# Altium project MB1272.PrjPcb (part 3 of 5)

## Sheet ST_LINK_V2-1.SCHDOC: ST-LINK/V2-1 with support of SWD only
size A4; Project: STM32MP15-DISCO PI; Date: Not used; ApprovedBy: Not used; CheckedBy: Not used; Author: Not used; CompanyName: STMicroelectronics; DrawnBy: Not used; Engineer: Not used; Organization: Not used; Address1: Not used; Address2: Not used; Address3: Not used; Address4: Not used; DocumentNumber: 15; Revision: Not used; SheetNumber: 15; SheetTotal: 15; CurrentTime: Not used; CurrentDate: Not used; Time: Not used; DocumentFullPathAndName: Not used; DocumentName: Not used; ModifiedDate: Not used; ImagePath: Not used; ProjectName: Not used; Application_BuildNumber: Not used
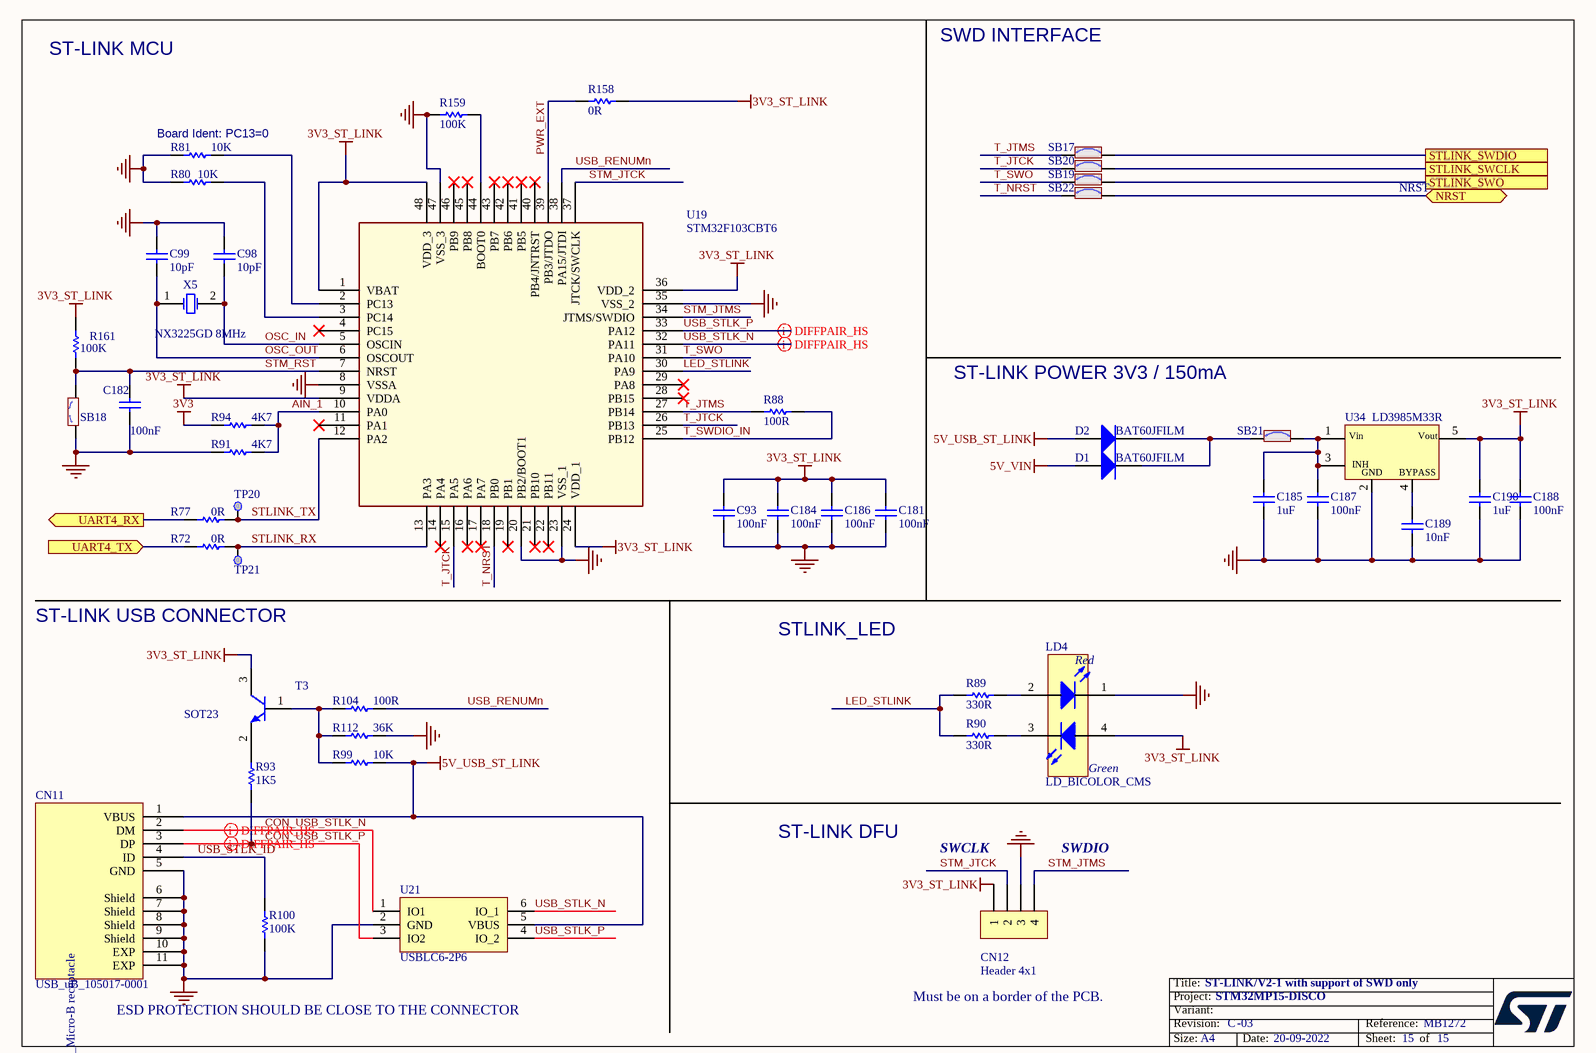
[diagram p6: ST_LINK_V2-1.SCHDOC]

### Parts
C93  value 100nF  [C0402]
C98  value 10pF  [C0402]
C99  value 10pF  [C0402]
C181  value 100nF  [C0402]
C182  value 100nF  [C0402]
C184  value 100nF  [C0402]
C185  value 1uF  [C0603]
C186  value 100nF  [C0402]
C187  value 100nF  [C0402]
C188  value 100nF  [C0402]
C189  value 10nF  [C0402]
C190  value 1uF  [C0603]
CN11  value USB_uB_105017-0001  [CON_USBMICROB_MOLEX_105017-0001_H2P90]
CN12  value Header 4x1  [CON_SAMTEC_TSW-104-07-G-S]
D1  value BAT60JFILM  [DIO_SOD323]
D2  value BAT60JFILM  [DIO_SOD323]
LD4  LD_BICOLOR_CMS  [LED_BI-GR_HSMF-A201-A00J1]
R72  value 0R  [R0402]
R77  value 0R  [R0402]
R80  value 10K  [R0402]
R81  value 10K  [R0402]
R88  value 100R  [R0402]
R89  value 330R  [R0402]
R90  value 330R  [R0402]
R91  value 4K7  [R0402]
R93  value 1K5  [R0402]
R94  value 4K7  [R0402]
R99  value 10K  [R0402]
R100  value 100K  [R0402]
R104  value 100R  [R0402]
R112  value 36K  [R0402]
R158  value 0R  [R0402]
R159  value 100K  [R0402]
R161  value 100K  [R0402]
SB17  (no value)  [SOLDER-BRIDGE_R0603-0R]
SB18  (no value)  [SOLDER-BRIDGE_R0603-0R]
SB19  (no value)  [SOLDER-BRIDGE_R0603-0R]
SB20  (no value)  [SOLDER-BRIDGE_R0603-0R]
SB21  (no value)  [SOLDER-BRIDGE_R0603-0R]
SB22  (no value)  [SOLDER-BRIDGE_R0603-0R]
T3  value SOT23  [NPN_SOT23]
TP20  Test Point  [TP_SMD_1MM]  (value not drawn)  (no BOM)
TP21  Test Point  [TP_SMD_1MM]  (value not drawn)  (no BOM)
U19  value STM32F103CBT6  [ICC_LQFP48_7X7_P050]
U21  value USBLC6-2P6  [ESD_SOT666]
U34  value LD3985M33R  [REG_SOT23-5L]
X5  value NX3225GD 8MHz  [CRY_NX3225GD_2P]

### Ports
NRST (bidir), STLINK_SWCLK, STLINK_SWDIO, STLINK_SWO, UART4_RX (out), UART4_TX (in)

### Nets
3V3: R94.1
3V3_ST_LINK: C93.2 C181.2 C184.2 C186.2 C188.2 C190.2 CN12.1 LD4.4(YellowGreen_anode) R158.2 R161.2 T3.3(C) U19.1(VBAT) U19.9(VDDA) U19.24(VDD_1) U19.36(VDD_2) U19.48(VDD_3) U34.5(Vout)
5V_USB_ST_LINK: CN11.1(VBUS) D2.1(A) R99.1 U21.5(VBUS)
5V_VIN: D1.1(A)
GND: C93.1 C98.2 C99.2 C181.1 C182.1 C184.1 C185.2 C186.1 C187.1 C188.1 C189.1 C190.1 CN11.5(GND) CN11.6(Shield) CN11.7(Shield) CN11.8(Shield) CN11.9(Shield) CN11.10(EXP) CN11.11(EXP) CN12.3 LD4.1(RED_cathode) R80.1 R81.2 R91.1 R100.1 R112.1 R159.1 SB18.1 U19.8(VSSA) U19.20(PB2/BOOT1) U19.23(VSS_1) U19.35(VSS_2) U19.47(VSS_3) U21.2(GND) U34.2(GND)
AIN_1: R91.2 R94.2 U19.10(PA0)
CON_USB_STLK_N: CN11.2(DM) U21.1(IO1)
CON_USB_STLK_P: CN11.3(DP) R93.1 U21.3(IO2)
JTDO_TRACESWO: SB19.2 ; port STLINK_SWO
LED_STLINK: R89.2 R90.2 U19.30(PA9)
NRST: SB22.2 ; port NRST
OSC_IN: C98.1 U19.5(OSCIN) X5.2(OSC2)
OSC_OUT: C99.1 U19.6(OSCOUT) X5.1(OSC1)
PWR_EXT: R158.1 U19.39(PB3/JTDO)
STLINK_RX: R72.2 TP21.1 U19.13(PA3)
STLINK_SWCLK: SB20.2 ; port STLINK_SWCLK
STLINK_SWDIO: SB17.2 ; port STLINK_SWDIO
STLINK_TX: R77.1 TP20.1 U19.12(PA2)
STM_JTCK: CN12.2 U19.37(JTCK/SWCLK)
STM_JTMS: CN12.4 U19.34(JTMS/SWDIO)
STM_RST: C182.2 R161.1 SB18.2 U19.7(NRST)
T_JTCK: SB20.1 U19.15(PA5) U19.26(PB13)
T_JTMS: R88.1 SB17.1 U19.27(PB14)
T_NRST: SB22.1 U19.18(PB0)
T_SWDIO_IN: R88.2 U19.25(PB12)
T_SWO: SB19.1 U19.31(PA10)
UART4_RX: R77.2 ; port UART4_RX
UART4_TX: R72.1 ; port UART4_TX
USB_RENUMn: R104.2 U19.38(PA15/JTDI)
USB_STLK_ID: CN11.4(ID) R100.2
USB_STLK_N: U19.32(PA11) U21.6(IO_1)
USB_STLK_P: U19.33(PA12) U21.4(IO_2)
NetC185_1: C185.1 C187.2 SB21.2 U34.1(Vin) U34.3(CE)
NetC189_2: C189.2 U34.4(BYPASS)
NetD1_2: D1.2(K) D2.2(K) SB21.1
NetLD4_2: LD4.2(Red_anode) R89.1
NetLD4_3: LD4.3(YellowGreen_cathode) R90.1
NetR80_2: R80.2 U19.3(PC14)
NetR81_1: R81.1 U19.2(PC13)
NetR93_2: R93.2 T3.2(E)
NetR99_2: R99.2 R104.1 R112.2 T3.1(B)
NetR159_2: R159.2 U19.44(BOOT0)

Not connected (* = marked no-connect by the designer): U19 4(PC15)* 11(PA1)* 14(PA4)* 16(PA6)* 17(PA7)* 19(PB1)* 21(PB10)* 22(PB11)* 28(PB15)* 29(PA8)* 40(PB4/JNTRST)* 41(PB5)* 42(PB6)* 43(PB7)* 45(PB8)* 46(PB9)*

### Layout directives
differential pair: CON_USB_STLK_N, CON_USB_STLK_P, USB_STLK_N, USB_STLK_P

### Notes on the sheet
- ST-LINK MCU
- SWD INTERFACE
- (near R81) Board Ident: PC13=0
- NRST
- ST-LINK POWER 3V3 / 150mA
- ST-LINK USB CONNECTOR
- STLINK_LED
- ST-LINK DFU
- SWCLK
- SWDIO
- Must be on a border of the PCB.
- (near CN11) ESD PROTECTION SHOULD BE CLOSE TO THE CONNECTOR
- Title:
- Project:
- Size:
- Revision:
- Variant:
- A4
- -
- Date:
- Reference:
- Sheet:
- of
- (in symbol MCD-00028) USB_Micro-B receptacle
- (in symbol MCD-00086) INH
- (in symbol MCD-02402) Red; Green

### Library data of the parts
C93 C181 C182 C184 C186-C188 = MCD-00006: Capacitor,100nF,16V,X7R,10%,0402; Manufacturer_Part_Number: CC0402KRX7R7BB104; Manufacturer: YAGEO; Alternate_Manufacturer: MURATA; Alternate_Manufacturer_Part_Number: GCM155R71C104KA55D; Provided_By: SUBCO; Initial_Board_Reference: mb1274; Internal_Part_Number: MCD-00006; ComponentLink1Description: Datasheet; ECCN_US: n/a; ECCN_EU: n/a; Status: Released; Part_Type: Capacitor; Package: C0402; ComponentLink1URL: http://tunmcdsvn.tun.st.com/Component_Datasheet_Library/Trunk/Capacitors/Yageo_Multilayer_Capacitor_X7R_series_100pF_to_22uF
C98 C99 = MCD-00015: Capacitor,10pF,50V,NPO,5%,0402; Manufacturer_Part_Number: CC0402JRNPO9BN100; Manufacturer: YAGEO; Provided_By: SUBCO; Initial_Board_Reference: mb1274; Internal_Part_Number: MCD-00015; ComponentLink1Description: Datasheet; ECCN_US: n/a; ECCN_EU: n/a; Status: Released; Part_Type: Capacitor; Package: C0402; ComponentLink1URL: http://tunmcdsvn.tun.st.com/Component_Datasheet_Library/Trunk/Capacitors/Yageo_Capacitor_NP0_16V-to-50V
C185 C190 = MCD-00238: Capacitor,1uF,6V3,X5R,10%,0603; Manufacturer_Part_Number: CC0603KRX5R5BB105; Manufacturer: YAGEO; Provided_By: SUBCO; Initial_Board_Reference: mb1319; Internal_Part_Number: MCD-00238; ComponentLink1Description: Datasheet; ECCN_US: n/a; ECCN_EU: n/a; Status: Released; Part_Type: Capacitor; Package: C0603; ComponentLink1URL: http://tunmcdsvn.tun.st.com/Component_Datasheet_Library/Trunk/Capacitors/Yageo_Multilayer_capacitor_X5R_series_100pF_to_100uF
C189 = MCD-00011: Capacitor,10nF,16V,X7R,10%,0402; Manufacturer_Part_Number: CC0402KRX7R7BB103; Manufacturer: YAGEO; Provided_By: SUBCO; Initial_Board_Reference: mb1274; Internal_Part_Number: MCD-00011; ComponentLink1Description: Datasheet; ECCN_US: n/a; ECCN_EU: n/a; Status: Released; Part_Type: Capacitor; Package: C0402; ComponentLink1URL: http://tunmcdsvn.tun.st.com/Component_Datasheet_Library/Trunk/Capacitors/Yageo_Multilayer_Capacitor_X7R_series_100pF_to_22uF
CN11 = MCD-00028: USB-MICRO-B, 0.65mm, RA, SMT, Bottom Mount,; Manufacturer_Part_Number: 1050170001; Manufacturer: MOLEX; Part_Type: Connector; Provided_By: SUBCO; Initial_Board_Reference: mb1274; Internal_Part_Number: MCD-00028; ComponentLink1Description: Datasheet; ECCN_US: n/a; ECCN_EU: n/a; Status: Released; ComponentLink1URL: http://tunmcdsvn.tun.st.com/Component_Datasheet_Library/Trunk/Connectors/Molex_Connector-USB-microB_105017-0001
CN12 = MCD-00029: Header, 4x1, 2,54mm, VR, TH, Height 5.84mm/2.54mm; Manufacturer_Part_Number: TSW-104-07-x-S; Manufacturer: SAMTEC; Part_Type: Connector; Provided_By: SUBCO; Initial_Board_Reference: mb1274; Internal_Part_Number: MCD-00029; ComponentLink1Description: Datasheet; ECCN_US: n/a; ECCN_EU: n/a; Status: Released; ComponentLink1URL: http://tunmcdsvn.tun.st.com/Component_Datasheet_Library/Trunk/Connectors/Samtec_TSW-HTSW-series
D1 D2 = MCD-00034: BAT60JFILM; Manufacturer: STMICROELECTRONICS; Part_Type: Diode; BMS_Part_Number: 9151097; ECCN_US: EAR99; ECCN_EU: NEC; Provided_By: SUBCO with ST control; Initial_Board_Reference: mb1274; Internal_Part_Number: MCD-00034; Manufacturer_Part_Number: BAT60JFILM; ComponentLink1Description: Datasheet; Status: Released; ComponentLink1URL: http://tunmcdsvn.tun.st.com/Component_Datasheet_Library/Trunk/Diodes/STM_Diode_BAT60JFILM-SOD323
LD4 = MCD-02402: LED Bicolor; Part_Type: Display; Part_Preference: Alternate; Manufacturer: EVERLIGHT; Manufacturer_Part_Number: 67-22sursygc-s530-a2-tr8; Full_Alternate_Internal_Part_Number: MCD-00051, MCD-02631; Alternate_EMS: C; ShowFields: YES; ID: 4508; Internal_Part_Number: MCD-02402; Value: LD_BICOLOR_CMS; Status: Released; ComponentLink1URL: http://tunmcdsvn.tun.st.com/Component_Documentation_Library/Trunk/Display/EVERLIGHT_67-22sursygc-s530-a2-tr8; Order_Code_Digikey: N/A; Order_Code_Farnell: N/A; Order_Code_RS: N/A
R72 R77 R158 = MCD-00052: Resistor,0R,0402,5%,1/16W; Manufacturer_Part_Number: RC0402JR-070RL; Manufacturer: YAGEO; Provided_By: SUBCO; Initial_Board_Reference: mb1274; Internal_Part_Number: MCD-00052; ComponentLink1Description: Datasheet; ECCN_US: n/a; ECCN_EU: n/a; Status: Released; Part_Type: Resistor; ComponentLink1URL: http://tunmcdsvn.tun.st.com/Component_Datasheet_Library/Trunk/Resistors/Yageo_Resistor_RC0402-series; Package: R0402
R80 R81 R99 = MCD-00053: Resistor,10K,0402,1%,1/16W; Manufacturer_Part_Number: RC0402FR-0710KL; Manufacturer: YAGEO; Provided_By: SUBCO; Initial_Board_Reference: mb1274; Internal_Part_Number: MCD-00053; ComponentLink1Description: Datasheet; ECCN_US: n/a; ECCN_EU: n/a; Status: Released; Part_Type: Resistor; ComponentLink1URL: http://tunmcdsvn.tun.st.com/Component_Datasheet_Library/Trunk/Resistors/Yageo_Resistor_RC0402-series; Package: R0402
R88 R104 = MCD-00067: Resistor,100R,0402,1%,1/16W; Manufacturer_Part_Number: RC0402FR-07100RL; Manufacturer: YAGEO; Provided_By: SUBCO; Initial_Board_Reference: mb1274; Internal_Part_Number: MCD-00067; ComponentLink1Description: Datasheet; ECCN_US: n/a; ECCN_EU: n/a; Status: Released; Part_Type: Resistor; ComponentLink1URL: http://tunmcdsvn.tun.st.com/Component_Datasheet_Library/Trunk/Resistors/Yageo_Resistor_RC0402-series; Package: R0402
R89 R90 = MCD-00062: Resistor,330R,0402,1%,1/16W; Manufacturer_Part_Number: RC0402FR-07330RL; Manufacturer: YAGEO; Provided_By: SUBCO; Initial_Board_Reference: mb1274; Internal_Part_Number: MCD-00062; ComponentLink1Description: Datasheet; ECCN_US: n/a; ECCN_EU: n/a; Status: Released; Part_Type: Resistor; ComponentLink1URL: http://tunmcdsvn.tun.st.com/Component_Datasheet_Library/Trunk/Resistors/Yageo_Resistor_RC0402-series; Package: R0402
R91 R94 = MCD-00065: Resistor,4K7,0402,1%,1/16W; Manufacturer_Part_Number: RC0402FR-074K7L; Manufacturer: YAGEO; Alternate_Manufacturer_Part_Number: RT0402FRE074K7L; Provided_By: SUBCO; Initial_Board_Reference: mb1274; Internal_Part_Number: MCD-00065; Alternate_Manufacturer: YAGEO; ComponentLink1Description: Datasheet; ECCN_US: n/a; ECCN_EU: n/a; Status: Released; Part_Type: Resistor; ComponentLink1URL: http://tunmcdsvn.tun.st.com/Component_Datasheet_Library/Trunk/Resistors/Yageo_Resistor_RC0402-series; Package: R0402
R93 = MCD-00068: Resistor,1K5,0402,1%,1/16W; Manufacturer_Part_Number: RC0402FR-071K5L; Manufacturer: YAGEO; Provided_By: SUBCO; Initial_Board_Reference: mb1274; Internal_Part_Number: MCD-00068; ComponentLink1Description: Datasheet; ECCN_US: n/a; ECCN_EU: n/a; Status: Released; Part_Type: Resistor; ComponentLink1URL: http://tunmcdsvn.tun.st.com/Component_Datasheet_Library/Trunk/Resistors/Yageo_Resistor_RC0402-series; Package: R0402
R100 R159 R161 = MCD-00059: Resistor,100K,0402,1%,1/16W; Manufacturer_Part_Number: RC0402FR-07100KL; Manufacturer: YAGEO; Alternate_Manufacturer_Part_Number: RT0402FRE07100KL; Provided_By: SUBCO; Initial_Board_Reference: mb1274; Internal_Part_Number: MCD-00059; Alternate_Manufacturer: YAGEO; ComponentLink1Description: Datasheet; ECCN_US: n/a; ECCN_EU: n/a; Status: Released; Part_Type: Resistor; ComponentLink1URL: http://tunmcdsvn.tun.st.com/Component_Datasheet_Library/Trunk/Resistors/Yageo_Resistor_RC0402-series; Package: R0402
R112 = MCD-00069: Resistor,36K,0402,1%,1/16W; Manufacturer_Part_Number: RC0402FR-0736KL; Manufacturer: YAGEO; Provided_By: SUBCO; Initial_Board_Reference: mb1274; Internal_Part_Number: MCD-00069; ComponentLink1Description: Datasheet; ECCN_US: n/a; ECCN_EU: n/a; Status: Released; Part_Type: Resistor; ComponentLink1URL: http://tunmcdsvn.tun.st.com/Component_Datasheet_Library/Trunk/Resistors/Yageo_Resistor_RC0402-series; Package: R0402
SB17 SB19-SB22 = MCD-00071: Solder Bridge ON; Part_Type: Mechanical; Manufacturer: YAGEO; Manufacturer_Part_Number: RC0603JR-070RL; Provided_By: SUBCO; Initial_Board_Reference: mb1274; Internal_Part_Number: MCD-00071; ECCN_US: n/a; ECCN_EU: n/a; Status: Released; ComponentLink1Description: Datasheet; ComponentLink1URL: http://tunmcdsvn.tun.st.com/Component_Datasheet_Library/Trunk/Resistors/Yageo_Resistor_RC0603-series; Package: SB0603
SB18 = MCD-00072: Solder Bridge OFF; Part_Type: Mechanical; Manufacturer: YAGEO; Manufacturer_Part_Number: RC0603JR-070RL; Provided_By: SUBCO; Initial_Board_Reference: mb1274; Internal_Part_Number: MCD-00072; ECCN_US: n/a; ECCN_EU: n/a; Status: Released; ComponentLink1Description: Datasheet; ComponentLink1URL: http://tunmcdsvn.tun.st.com/Component_Datasheet_Library/Trunk/Resistors/Yageo_Resistor_RC0603-series; Package: SB0603
T3 = MCD-00073: NPN Bipolar Transistor; Manufacturer_Part_Number: BSR14; Manufacturer: ON SEMICONDUCTOR; Part_Type: IC; Alternate_Manufacturer_Part_Number: MMBT2222ALT1G / MMBT2222ALT3G; ECCN_US: EAR99; ECCN_EU: NEC; Provided_By: SUBCO; Initial_Board_Reference: mb1274; Revision: *; Internal_Part_Number: MCD-00073; ComponentLink1Description: Datasheet; Status: Released; ComponentLink1URL: http://tunmcdsvn.tun.st.com/Component_Datasheet_Library/Trunk/IC/NXP_Transistor_BSR14; Alternate_Manufacturer: ON SEMICONDUCTOR
TP20 TP21 = MCD-00074: Test Point 1mm; Part_Type: Mechanical; Initial_Board_Reference: MB1274; Internal_Part_Number: MCD-00074; Status: Released; Manufacturer_Part_Number: n/a; Manufacturer: n/a; ComponentLink1Description: Datasheet; ComponentLink1URL: http://na; ECCN_US: n/a; ECCN_EU: n/a; Provided_By: n/a
U19 = MCD-00085: Medium-density performance line ARM-based 32-bit MCU with 128KB Flash; Manufacturer: STMICROELECTRONICS; Part_Type: IC; BMS_Part_Number: 9175111; ECCN_US: 3A991A2; ECCN_EU: NEC; Provided_By: SUBCO with ST control; Initial_Board_Reference: mb1274; Internal_Part_Number: MCD-00085; Manufacturer_Part_Number: STM32F103CBT6; ComponentLink1Description: Datasheet; Status: Released; ComponentLink1URL: http://tunmcdsvn.tun.st.com/Component_Datasheet_Library/Trunk/IC/STM_STM32F103CBT6
U21 = MCD-00169: USB OTG FS ESD protection; Manufacturer: STMICROELECTRONICS; Part_Type: IC; BMS_Part_Number: 9151057; Provided_By: SUBCO with ST control; ECCN_US: EAR99; ECCN_EU: NEC; Initial_Board_Reference: MB1274; Internal_Part_Number: MCD-00169; Manufacturer_Part_Number: USBLC6-2P6; ComponentLink1Description: Datasheet; Status: Released; ComponentLink1URL: http://tunmcdsvn.tun.st.com/Component_Datasheet_Library/Trunk/Diodes/STM_ESD_USBLC6-2
U34 = MCD-00086: Ultra low drop-low noise BiCMOS voltage, regulators low ESR capacitors compatible; Manufacturer: STMICROELECTRONICS; Part_Type: IC; BMS_Part_Number: 9176161; ECCN_US: EAR99; ECCN_EU: NEC; Provided_By: SUBCO with ST control; Initial_Board_Reference: mb1274; Internal_Part_Number: MCD-00086; Manufacturer_Part_Number: LD3985M33R; ComponentLink1Description: Datasheet; Status: Released; ComponentLink1URL: http://tunmcdsvn.tun.st.com/Component_Datasheet_Library/Trunk/IC/STM_LDO_LD3985
X5 = MCD-00092: Crystal 8Mhz, 8pF, -+50PPM, SMD; Manufacturer_Part_Number: NX3225GD 8MHz EXS00A-CG04874; Manufacturer: NDK; Part_Type: Crystal_Osc; BMS_Part_Number: 9157029; ECCN_US: EAR99; ECCN_EU: NEC; Provided_By: SUBCO; Initial_Board_Reference: mb1274; Internal_Part_Number: MCD-00092; ComponentLink1Description: Datasheet; Status: Released; ComponentLink1URL: http://tunmcdsvn.tun.st.com/Component_Datasheet_Library/Trunk/Crystal_Osc/NDK_Crystal-For-ST_NX3225GD 8MHz EXS00A-CG04874 (EXS10B-20725)

## Sheet GPIO_&_Arduino_ Connectors.SchDoc: GPIO_&_Arduino_ Connectors
size A3; Project: STM32MP15-DISCO PI; Date: Not used; ApprovedBy: Not used; CheckedBy: Not used; Author: Not used; CompanyName: STMicroelectronics; DrawnBy: Not used; Engineer: Not used; Organization: Not used; Address1: Not used; Address2: Not used; Address3: Not used; Address4: Not used; DocumentNumber: 10; Revision: Not used; SheetNumber: 10; SheetTotal: 15; CurrentTime: Not used; CurrentDate: Not used; Time: Not used; DocumentFullPathAndName: Not used; DocumentName: Not used; ModifiedDate: Not used; ImagePath: Not used; ProjectName: Not used; Application_BuildNumber: Not used
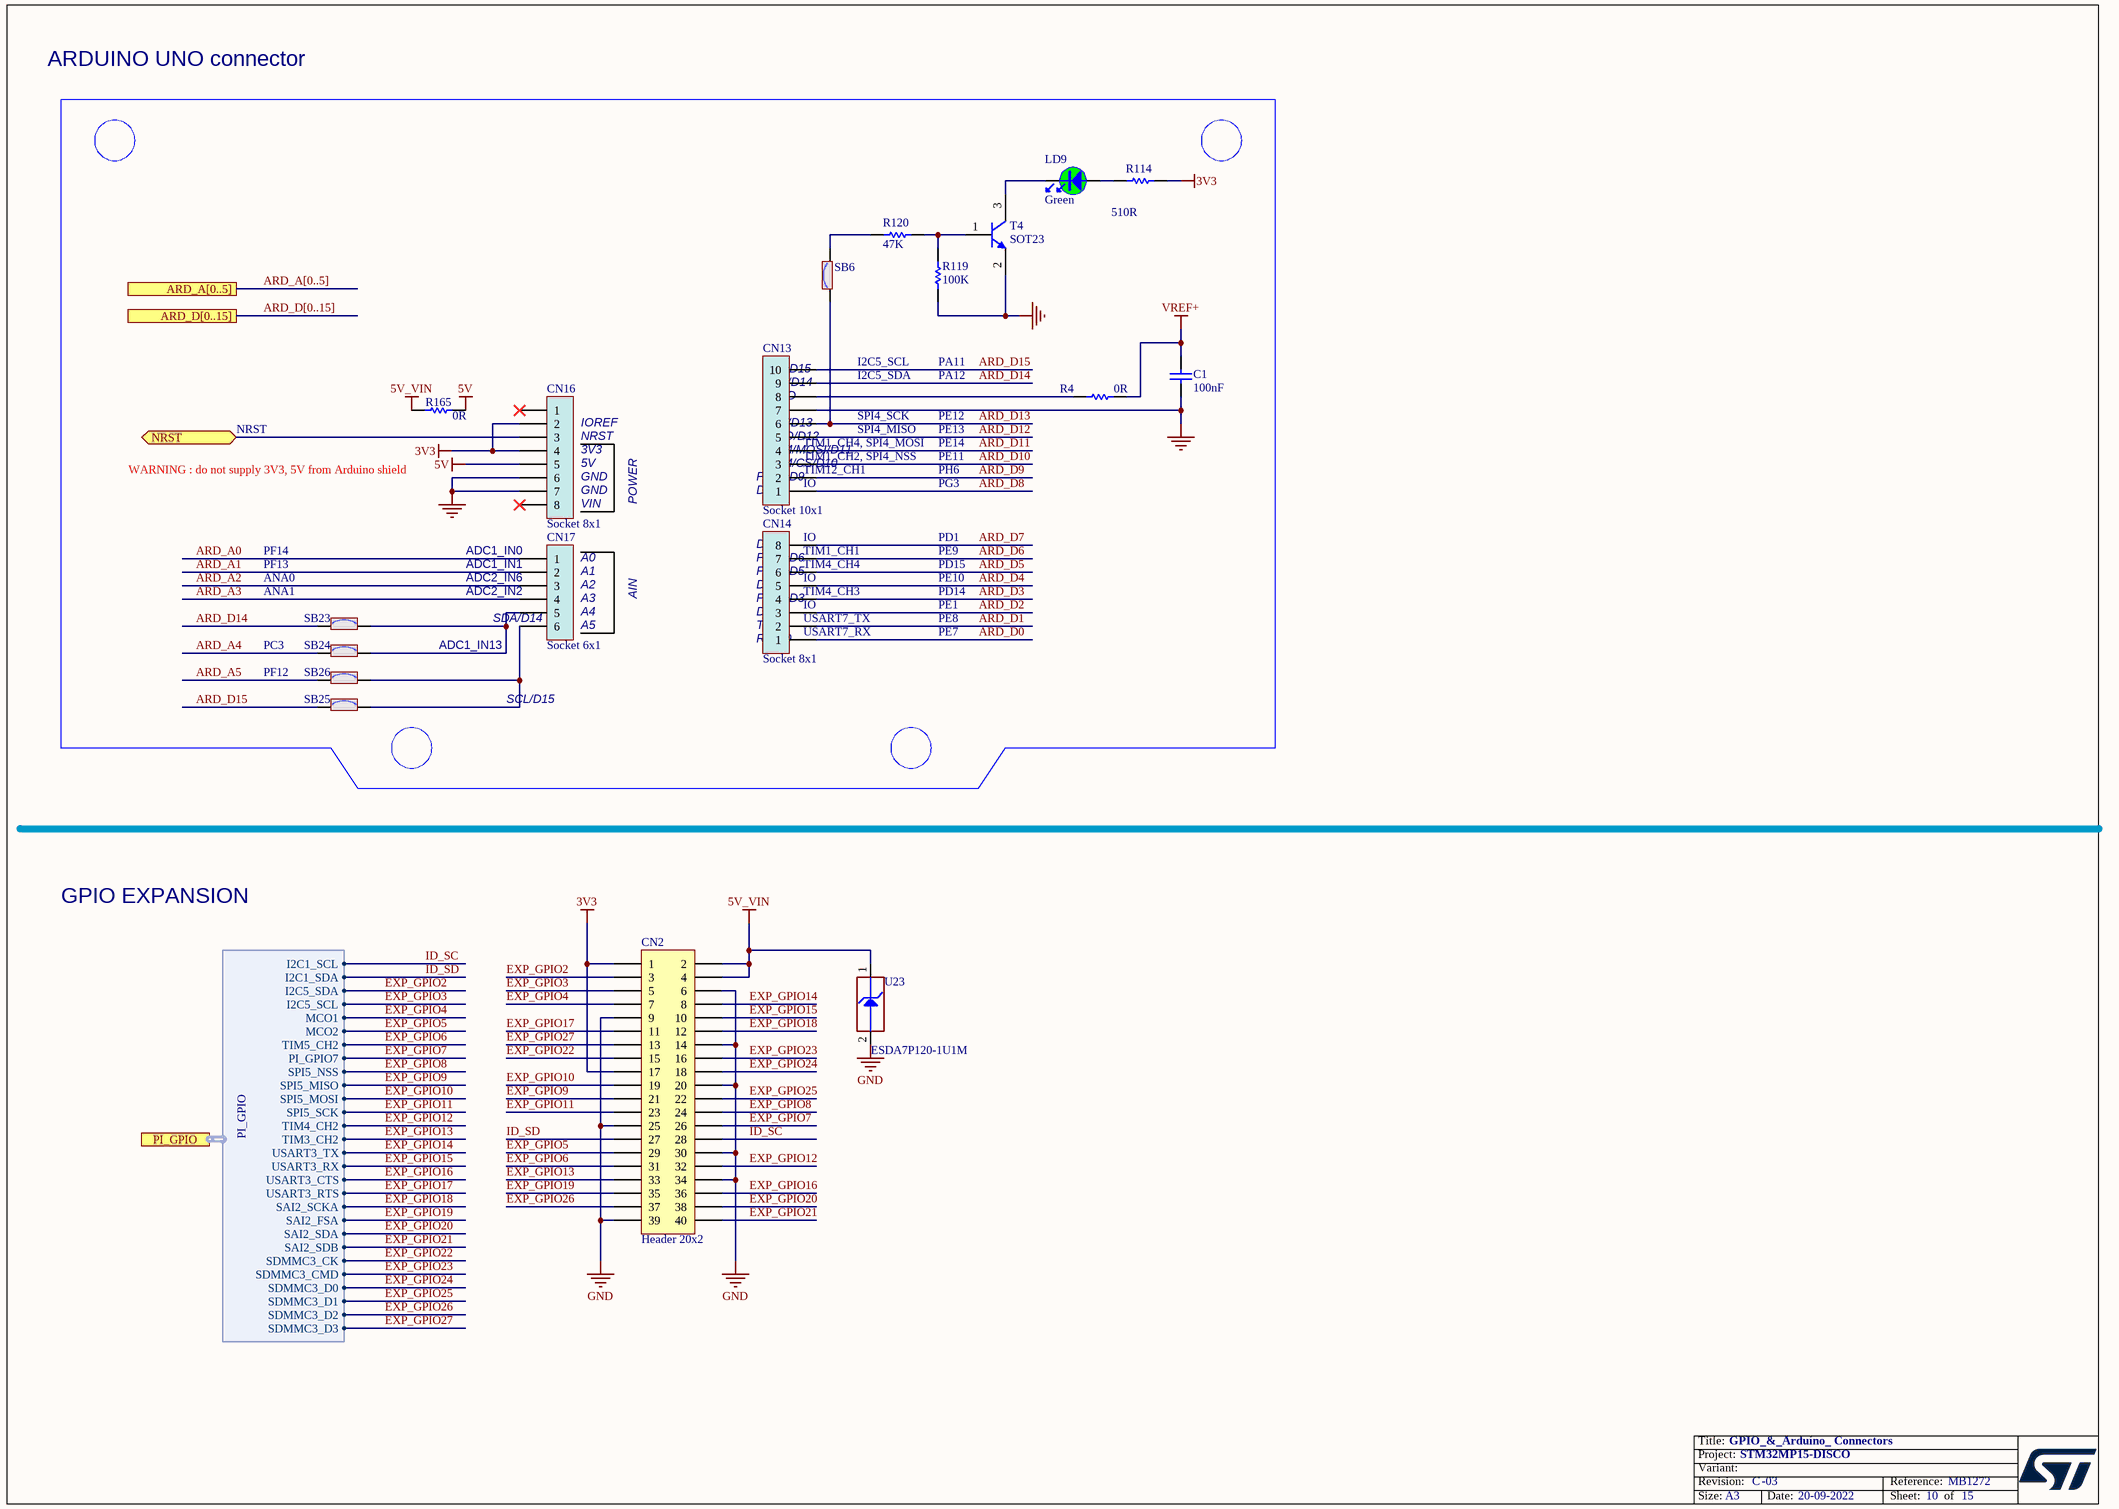
[diagram p7: GPIO_&_Arduino_ Connectors.SchDoc]

### Parts
C1  value 100nF  [C0402]
CN2  value Header 20x2  [CON_SAMTEC_TSW-120-07-G-D]
CN13  value Socket 10x1  [CON_SAMTEC_SSW-110-22-X-S-VS]
CN14  value Socket 8x1  [CON_SAMTEC_SSW-108-22-X-S-VS]
CN16  value Socket 8x1  [CON_SAMTEC_SSW-108-22-X-S-VS]
CN17  value Socket 6x1  [CON_SAMTEC_SSW-106-22-X-S-VS]
LD9  value Green  [LED_0603_GREEN]  (hidden comment: LED_green)
R4  value 0R  [R0402]
R114  value 510R  [R0402]
R119  value 100K  [R0402]
R120  value 47K  [R0402]
R165  value 0R  [R0402]
SB6  (no value)  [SOLDER-BRIDGE_R0603-0R]
SB23  SB_ON  [SOLDER-BRIDGE_R0603-0R]  (value not drawn)
SB24  (no value)  [SOLDER-BRIDGE_R0603-0R]
SB25  SB_ON  [SOLDER-BRIDGE_R0603-0R]  (value not drawn)
SB26  (no value)  [SOLDER-BRIDGE_R0603-0R]
T4  value SOT23  [NPN_SOT23]
U23  value ESDA7P120-1U1M  [ESD_QFN1610_2N_1K_2A]  (hidden comment: ​Footprint needed DFN105P160X60-2N)

### Ports
ARD_A[0..5], ARD_D[0..15], NRST (bidir), PI_GPIO (harness PI_GPIO)

### Harnesses
PI_GPIO: I2C1_SCL, I2C1_SDA, I2C5_SDA, MCO1, MCO2, TIM5_CH2, PI_GPIO7, SPI5_NSS, SPI5_MISO, SPI5_MOSI, SPI5_SCK, TIM4_CH2, TIM3_CH2, USART3_TX, USART3_RX, USART3_CTS, USART3_RTS, SDMMC3_CK, SDMMC3_CMD, SDMMC3_D0, SDMMC3_D1, SDMMC3_D2, SDMMC3_D3, I2C5_SCL, SAI2_SCKA, SAI2_FSA, SAI2_SDA, SAI2_SDB

### Nets
3V3: CN2.1 CN2.17 CN16.2 CN16.4 R114.2
5V: CN16.5 R165.2
5V_VIN: CN2.2 CN2.4 R165.1 U23.1(IO1)
GND: C1.1 CN2.6 CN2.9 CN2.14 CN2.20 CN2.25 CN2.30 CN2.34 CN2.39 CN13.7 CN16.6 CN16.7 R119.1 T4.2(E) U23.2(GND)
VREF+: C1.2 R4.2
ARD_A0: CN17.1
ARD_A1: CN17.2
ARD_A2: CN17.3
ARD_A3: CN17.4
ARD_A4: SB24.1
ARD_A5: SB26.1
ARD_D0: CN14.1
ARD_D1: CN14.2
ARD_D2: CN14.3
ARD_D3: CN14.4
ARD_D4: CN14.5
ARD_D5: CN14.6
ARD_D6: CN14.7
ARD_D7: CN14.8
ARD_D8: CN13.1
ARD_D9: CN13.2
ARD_D10: CN13.3
ARD_D11: CN13.4
ARD_D12: CN13.5
ARD_D13: CN13.6 SB6.1
ARD_D14: CN2.3 CN13.9 SB23.1 ; port PI_GPIO.I2C5_SDA  [also labelled EXP_GPIO2]
ARD_D15: CN2.5 CN13.10 SB25.1 ; port PI_GPIO.I2C5_SCL  [also labelled EXP_GPIO3]
EXP_GPIO4: CN2.7 ; port PI_GPIO.MCO1
EXP_GPIO5: CN2.29 ; port PI_GPIO.MCO2
EXP_GPIO6: CN2.31 ; port PI_GPIO.TIM5_CH2
EXP_GPIO7: CN2.26 ; port PI_GPIO.PI_GPIO7
EXP_GPIO8: CN2.24 ; port PI_GPIO.SPI5_NSS
EXP_GPIO9: CN2.21 ; port PI_GPIO.SPI5_MISO
EXP_GPIO10: CN2.19 ; port PI_GPIO.SPI5_MOSI
EXP_GPIO11: CN2.23 ; port PI_GPIO.SPI5_SCK
EXP_GPIO12: CN2.32 ; port PI_GPIO.TIM4_CH2
EXP_GPIO13: CN2.33 ; port PI_GPIO.TIM3_CH2
EXP_GPIO14: CN2.8 ; port PI_GPIO.USART3_TX
EXP_GPIO15: CN2.10 ; port PI_GPIO.USART3_RX
EXP_GPIO16: CN2.36 ; port PI_GPIO.USART3_CTS
EXP_GPIO17: CN2.11 ; port PI_GPIO.USART3_RTS
EXP_GPIO18: CN2.12 ; port PI_GPIO.SAI2_SCKA
EXP_GPIO19: CN2.35 ; port PI_GPIO.SAI2_FSA
EXP_GPIO20: CN2.38 ; port PI_GPIO.SAI2_SDA
EXP_GPIO21: CN2.40 ; port PI_GPIO.SAI2_SDB
EXP_GPIO22: CN2.15 ; port PI_GPIO.SDMMC3_CK
EXP_GPIO23: CN2.16 ; port PI_GPIO.SDMMC3_CMD
EXP_GPIO24: CN2.18 ; port PI_GPIO.SDMMC3_D0
EXP_GPIO25: CN2.22 ; port PI_GPIO.SDMMC3_D1
EXP_GPIO26: CN2.37 ; port PI_GPIO.SDMMC3_D2
EXP_GPIO27: CN2.13 ; port PI_GPIO.SDMMC3_D3
ID_SC: CN2.28 ; port PI_GPIO.I2C1_SCL  [project net I2C1_SCL]
ID_SD: CN2.27 ; port PI_GPIO.I2C1_SDA  [project net I2C1_SDA]
NRST: CN16.3 ; port NRST
NetCN13_8: CN13.8 R4.1
NetCN17_5: CN17.5 SB23.2 SB24.2
NetCN17_6: CN17.6 SB25.2 SB26.2
NetLD9_1: LD9.1 R114.1
NetLD9_2: LD9.2 T4.3(C)
NetR119_2: R119.2 R120.2 T4.1(B)
NetR120_1: R120.1 SB6.2

Not connected (* = marked no-connect by the designer): CN16 1* 8*

### Buses and harness runs
bus ARD_A[0..5] = port ARD_A[0..5]
bus ARD_D[0..15] = port ARD_D[0..15]

### Notes on the sheet
- ARDUINO UNO connector
- (near CN13) SCL/D15
- I2C5_SCL
- I2C5_SDA
- PA11
- PA12
- NRST
- (near CN16) IOREF
- (near CN16) NRST
- (near CN16) 3V3
- (near CN13) SDA/D14
- (near CN13) SCK/D13
- (near CN13) MISO/D12
- (near CN13) PWM/MOSI/D11
- (near CN13) AVDD
- (near CN13) GND
- (near CN13) TIM1_CH4, SPI4_MOSI
- SPI4_SCK
- SPI4_MISO
- PE14
- PE13
- PE12
- WARNING : do not supply 3V3, 5V from Arduino shield
- (near CN16) 5V
- (near CN16) GND
- (near CN16) VIN
- POWER
- (near CN13) D8
- (near CN13) PWM/D9
- (near CN13) PWM/CS/D10
- (near CN13) TIM12_CH1
- (near CN13) TIM1_CH2, SPI4_NSS
- (near CN13) IO
- PG3
- PH6
- PE11
- ANA0
- PF14
- PF13
- (near CN17) ADC2_IN6
- (near CN17) ADC1_IN1
- ADC1_IN0
- (near CN17) A0
- (near CN17) A1
- (near CN17) A2
- (near CN14) D4
- (near CN14) PWM/D5
- (near CN14) PWM/D6
- (near CN14) D7
- (near CN14) TIM4_CH4
- (near CN14) TIM1_CH1
- (near CN14) IO
- PE10
- PD15
- PE9
- PD1
- ANA1
- PC3
- ADC1_IN13
- (near CN17) ADC2_IN2
- SDA/D14
- (near CN17) A3
- (near CN17) A4
- (near CN17) A5
- AIN
- (near CN14) RX/D0
- (near CN14) TX/D1
- (near CN14) D2
- (near CN14) PWM/D3
- (near CN14) USART7_RX
- (near CN14) USART7_TX
- (near CN14) TIM4_CH3
- PE7
- PE8
- PE1
- PD14
- PF12
- SCL/D15
- GPIO EXPANSION
- Title:
- Project:
- Size:
- Revision:
- Variant:
- -
- Date:
- Reference:
- Sheet:
- of

### Library data of the parts
C1 = MCD-00006: as C93 on sheet ST_LINK_V2-1; Internal_Part_Number: MCD-00006; ComponentLink1Description: Datasheet; ECCN_US: n/a; ECCN_EU: n/a; Status: Released; Part_Type: Capacitor; Package: C0402; ComponentLink1URL: http://tunmcdsvn.tun.st.com/Component_Datasheet_Library/Trunk/Capacitors/Yageo_Multilayer_Capacitor_X7R_series_100pF_to_22uF
CN2 = MCD-00302: Header, 20x2, 2.54mm, VR, TH, Height 5.84mm/2.54mm; Manufacturer_Part_Number: TSW-120-07-G-D; Manufacturer: SAMTEC; Part_Type: Connector; Provided_By: SUBCO; Initial_Board_Reference: mb1272; Internal_Part_Number: MCD-00302; ComponentLink1Description: Datasheet; ComponentLink1URL: http://tunmcdsvn.tun.st.com/Component_Datasheet_Library/Trunk/Connectors/Samtec_TSW-HTSW-series; ECCN_US: n/a; ECCN_EU: n/a; Status: Checked
CN13 = MCD-00301: Socket, 10x1, 2.54mm, VR, SMT, Height 9.78mm; Part_Type: Connector; Manufacturer_Part_Number: SSW-110-22-L-S-VS; Manufacturer: SAMTEC; Provided_By: SUBCO; Initial_Board_Reference: mb1272; Internal_Part_Number: MCD-00301; Status: Checked; ComponentLink1Description: Datasheet; ComponentLink1URL: http://tunmcdsvn.tun.st.com/Component_Datasheet_Library/Trunk/Connectors/Samtec_SSW_smt_series; ECCN_US: n/a; ECCN_EU: n/a
CN14 CN16 = MCD-00300: Socket, 8x1, 2.54mm, VR, SMT, Height 9.78mm; Manufacturer_Part_Number: SSW-108-22-L-S-VS; Manufacturer: SAMTEC; Part_Type: Connector; Provided_By: SUBCO; Initial_Board_Reference: mb1272; Internal_Part_Number: MCD-00300; ComponentLink1Description: Datasheet; ComponentLink1URL: http://tunmcdsvn.tun.st.com/Component_Datasheet_Library/Trunk/Connectors/Samtec_SSW_smt_series; ECCN_US: n/a; ECCN_EU: n/a; Status: Checked
CN17 = MCD-00299: Socket, 6x1, 2.54mm, VR, SMT, Height 9.78mm; Manufacturer_Part_Number: SSW-106-22-L-S-VS; Manufacturer: SAMTEC; Part_Type: Connector; Provided_By: SUBCO; Initial_Board_Reference: mb1272; Internal_Part_Number: MCD-00299; ComponentLink1Description: Datasheet; ComponentLink1URL: http://tunmcdsvn.tun.st.com/Component_Datasheet_Library/Trunk/Connectors/Samtec_SSW_smt_series; ECCN_US: n/a; ECCN_EU: n/a; Status: Checked
LD9 = MCD-02900: LED, Green, 2V, 20mA, 0603; Part_Type: Display; Part_Preference: Recommended; Manufacturer: EVERLIGHT; Manufacturer_Part_Number: 19-213SYGC/S530-E2/5T; Full_Alternate_Internal_Part_Number: MCD-00320; Partial_Alternate_Internal_Part_Number: MCD-00050; Component_Country_Of_Origin: China; ShowFields: YES; ID: 5016; Internal_Part_Number: MCD-02900; Status: Checked; Package: 0603; ComponentLink1URL: http://tunmcdsvn.tun.st.com/Component_Documentation_Library/Trunk/Display/EVERLIGHT_19-213SYGC-S530-E2-5T; Order_Code_Digikey: 1080-19-213SYGC/S530-E2/5TTR-ND; Order_Code_Farnell: N/A; Order_Code_RS: N/A
R4 R165 = MCD-00052: as R72 on sheet ST_LINK_V2-1; Internal_Part_Number: MCD-00052; ComponentLink1Description: Datasheet; ECCN_US: n/a; ECCN_EU: n/a; Status: Released; Part_Type: Resistor; ComponentLink1URL: http://tunmcdsvn.tun.st.com/Component_Datasheet_Library/Trunk/Resistors/Yageo_Resistor_RC0402-series; Package: R0402
R114 = MCD-00064: Resistor,510R,0402,1%,1/16W; Manufacturer_Part_Number: RC0402FR-07510RL; Manufacturer: YAGEO; Provided_By: SUBCO; Initial_Board_Reference: mb1274; Internal_Part_Number: MCD-00064; ComponentLink1Description: Datasheet; ECCN_US: n/a; ECCN_EU: n/a; Status: Released; Part_Type: Resistor; ComponentLink1URL: http://tunmcdsvn.tun.st.com/Component_Datasheet_Library/Trunk/Resistors/Yageo_Resistor_RC0402-series; Package: R0402
R119 = MCD-00059: as R100 on sheet ST_LINK_V2-1; Internal_Part_Number: MCD-00059; Alternate_Manufacturer: YAGEO; ComponentLink1Description: Datasheet; ECCN_US: n/a; ECCN_EU: n/a; Status: Released; Part_Type: Resistor; ComponentLink1URL: http://tunmcdsvn.tun.st.com/Component_Datasheet_Library/Trunk/Resistors/Yageo_Resistor_RC0402-series; Package: R0402
R120 = MCD-00063: Resistor,47K,0402,1%,1/16W; Manufacturer_Part_Number: RC0402FR-0747KL; Manufacturer: YAGEO; Provided_By: SUBCO; Initial_Board_Reference: mb1274; Internal_Part_Number: MCD-00063; ComponentLink1Description: Datasheet; ECCN_US: n/a; ECCN_EU: n/a; Status: Released; Part_Type: Resistor; ComponentLink1URL: http://tunmcdsvn.tun.st.com/Component_Datasheet_Library/Trunk/Resistors/Yageo_Resistor_RC0402-series; Package: R0402
SB6 SB24 SB26 = MCD-00071: as SB17 on sheet ST_LINK_V2-1; Internal_Part_Number: MCD-00071; ECCN_US: n/a; ECCN_EU: n/a; Status: Released; ComponentLink1Description: Datasheet; ComponentLink1URL: http://tunmcdsvn.tun.st.com/Component_Datasheet_Library/Trunk/Resistors/Yageo_Resistor_RC0603-series; Package: SB0603
SB23 SB25 = MCD-00071: Solder Bridge ON; Part_Type: Mechanical; Manufacturer: YAGEO; Manufacturer_Part_Number: RC0603JR-070RL; Provided_By: SUBCO; Initial_Board_Reference: MB1274; Internal_Part_Number: MCD-00071; ECCN_US: n/a; ECCN_EU: n/a; Status: Released; ComponentLink1Description: Datasheet; ComponentLink1URL: http://tunmcdsvn.tun.st.com/Component_Datasheet_Library/Trunk/Resistors/Yageo_Resistor_RC0603-series; Package: SB0603
T4 = MCD-00073: as T3 on sheet ST_LINK_V2-1; Revision: *; Internal_Part_Number: MCD-00073; ComponentLink1Description: Datasheet; Status: Released; ComponentLink1URL: http://tunmcdsvn.tun.st.com/Component_Datasheet_Library/Trunk/IC/NXP_Transistor_BSR14; Alternate_Manufacturer: ON SEMICONDUCTOR
U23 = MCD-01026: High power transient voltage suppressor; Part_Type: Diode; Manufacturer: STMICROELECTRONICS; BMS_Part_Number: 9179046; ECCN_US: EAR99; ECCN_EU: NEC; Provided_By: SUBCO with ST control; Initial_Board_Reference: MB1378; Internal_Part_Number: MCD-01026; Status: Released; Manufacturer_Part_Number: ESDA7P120-1U1M; Package: QFN1610; ComponentLink1Description: Datasheet; ComponentLink1URL: http://tunmcdsvn.tun.st.com/Component_Datasheet_Library/Trunk/Diodes/STM_ESD_ESDA7P120-1U1M

## Sheet DSI_LCD.SchDoc: DSI_LCD_connector
size A4; Project: STM32MP15-DISCO PI; Date: Not used; ApprovedBy: Not used; CheckedBy: Not used; Author: Not used; CompanyName: STMicroelectronics; DrawnBy: Not used; Engineer: Not used; Organization: Not used; Address1: Not used; Address2: Not used; Address3: Not used; Address4: Not used; DocumentNumber: 7; Revision: Not used; SheetNumber: 8; SheetTotal: 15; CurrentTime: Not used; CurrentDate: Not used; Time: Not used; DocumentFullPathAndName: Not used; DocumentName: Not used; ModifiedDate: Not used; ImagePath: Not used; ProjectName: Not used; Application_BuildNumber: Not used
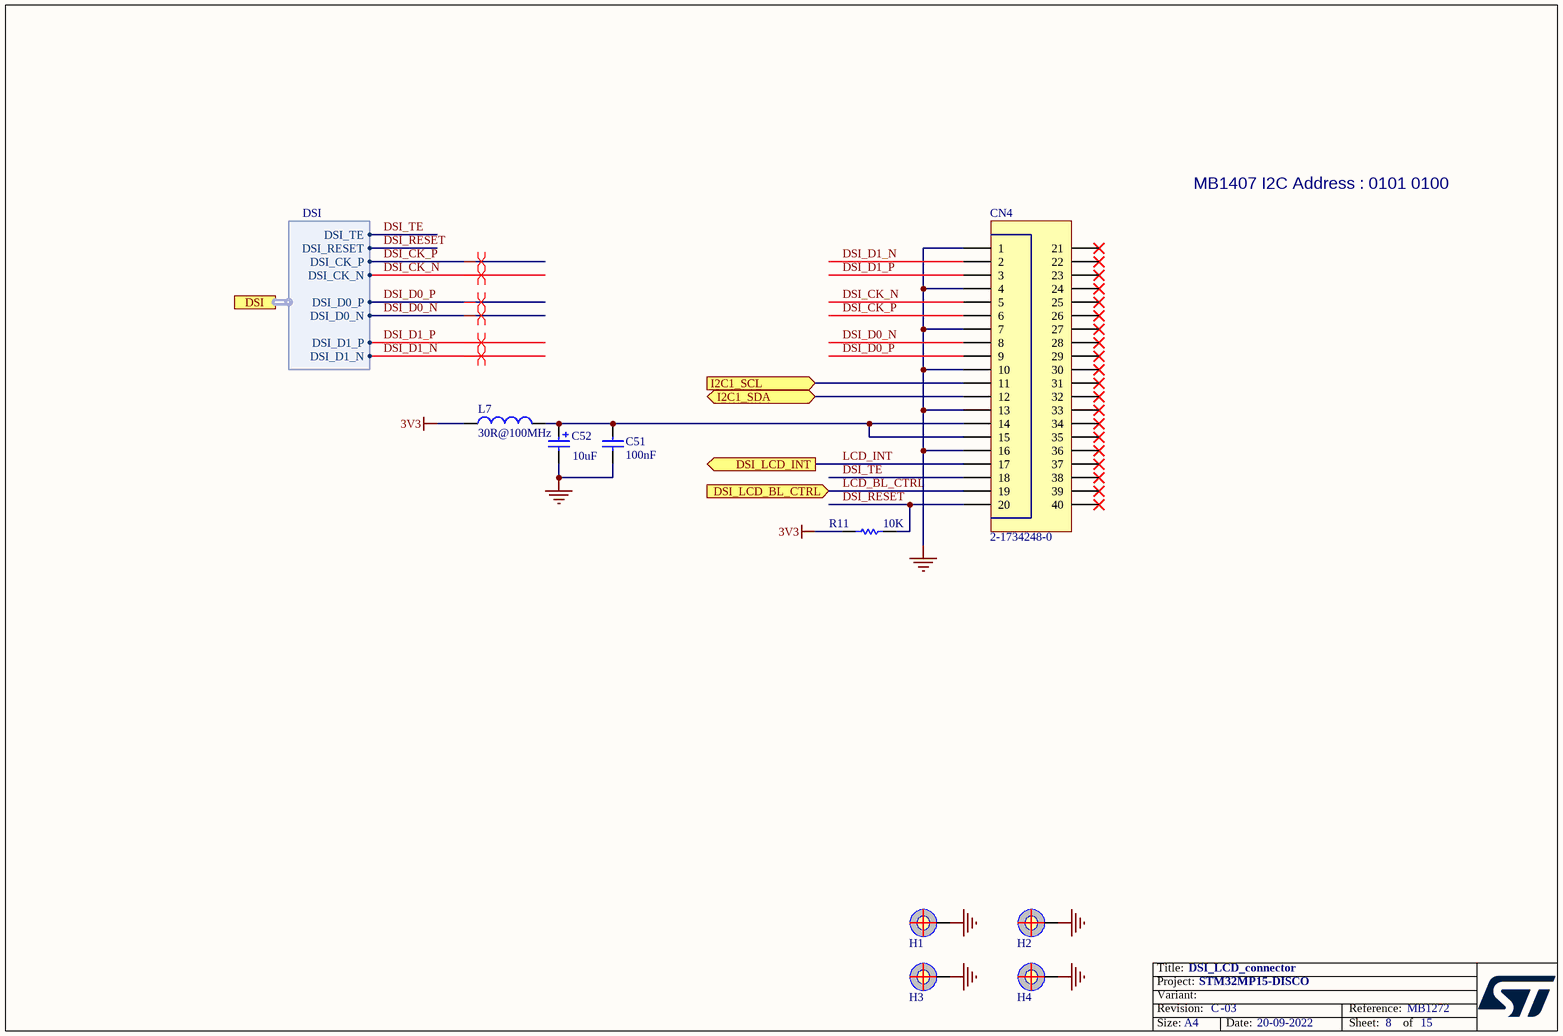
[diagram p8: DSI_LCD.SchDoc]

### Parts
C51  value 100nF  [C0402]
C52  value 10uF  [CPOL_TAJ-A_1206_H180]
CN4  value 2-1734248-0  [CON_TE-CONNECTIVITY_2-1734248-0]
H1  (no value)  [PTH_M1261-3005-N_3P5X6_M3_H14]  (no BOM)
H2  (no value)  [PTH_M1261-3005-N_3P5X6_M3_H14]  (no BOM)
H3  (no value)  [PTH_M1261-3005-N_3P5X6_M3_H14]  (no BOM)
H4  (no value)  [PTH_M1261-3005-N_3P5X6_M3_H14]  (no BOM)
L7  value 30R@100MHz  [L0603]  (hidden comment: BEAD)
R11  value 10K  [R0402]

### Ports
DSI (harness DSI), DSI_LCD_BL_CTRL (in), DSI_LCD_INT (out), I2C1_SCL (in), I2C1_SDA (bidir)

### Harnesses
DSI: DSI_CK_P, DSI_CK_N, DSI_D0_P, DSI_D0_N, DSI_D1_P, DSI_D1_N, DSI_TE, DSI_RESET

### Nets
3V3: L7.1 R11.1
GND: C51.1 C52.2 CN4.1 CN4.4 CN4.7 CN4.10 CN4.13 CN4.16 H1.1 H2.1 H3.1 H4.1
DSI_CK_N: CN4.5 ; port DSI.DSI_CK_N
DSI_CK_P: CN4.6 ; port DSI.DSI_CK_P
DSI_D0_N: CN4.8 ; port DSI.DSI_D0_N
DSI_D0_P: CN4.9 ; port DSI.DSI_D0_P
DSI_D1_N: CN4.2 ; port DSI.DSI_D1_N
DSI_D1_P: CN4.3 ; port DSI.DSI_D1_P
DSI_RESET: CN4.20 R11.2 ; port DSI.DSI_RESET
DSI_TE: CN4.18 ; port DSI.DSI_TE
I2C1_SCL: CN4.11 ; port I2C1_SCL
I2C1_SDA: CN4.12 ; port I2C1_SDA
LCD_BL_CTRL: CN4.19 ; port DSI_LCD_BL_CTRL  [project net DSI_LCD_BL_CTRL]
LCD_INT: CN4.17 ; port DSI_LCD_INT  [project net DSI_LCD_INT]
NetC51_2: C51.2 C52.1 CN4.14 CN4.15 L7.2

Not connected (* = marked no-connect by the designer): CN4 21* 22* 23* 24* 25* 26* 27* 28* 29* 30* 31* 32* 33* 34* 35* 36* 37* 38* 39* 40*

### Layout directives
differential pair: DSI_CK_N, DSI_CK_P, DSI_D0_N, DSI_D0_P, DSI_D1_N, DSI_D1_P

### Notes on the sheet
- MB1407 I2C Address : 0101 0100
- Title:
- Project:
- Size:
- Revision:
- Variant:
- A4
- -
- Date:
- Reference:
- Sheet:
- of

### Library data of the parts
C51 = MCD-00006: as C93 on sheet ST_LINK_V2-1; Internal_Part_Number: MCD-00006; ComponentLink1Description: Datasheet; ECCN_US: n/a; ECCN_EU: n/a; Status: Released; Part_Type: Capacitor; Package: C0402; ComponentLink1URL: http://tunmcdsvn.tun.st.com/Component_Datasheet_Library/Trunk/Capacitors/Yageo_Multilayer_Capacitor_X7R_series_100pF_to_22uF
C52 = MCD-00199: Polarized Capacitor,10uF,16V,10%,typeA; Manufacturer_Part_Number: TAJA106K016R; Manufacturer: AVX; Provided_By: SUBCO; ECCN_US: EAR99; ECCN_EU: NEC; Revision: July-2002: Re-released for DXP Platform.; Internal_Part_Number: MCD-00199; Status: Footprint available; Part_Type: Capacitor; ComponentLink1Description: Datasheet; ComponentLink1URL: http://tunmcdsvn.tun.st.com/Component_Datasheet_Library/Trunk/Capacitors/AVX_Capacitor_TAJ-series; Package: C1206
CN4 = MCD-01013: Socket ,TEConn,FCC/FPC, 20pins, 1.0mm,SMT, ZIF Receptacle; Part_Type: Connector; Manufacturer: TE CONNECTIVITY; Provided_By: SUBCO; Initial_Board_Reference: MB1272; Internal_Part_Number: MCD-01013; Status: Checked; Manufacturer_Part_Number: 2-1734248-0; ComponentLink1Description: Datasheet; ComponentLink1URL: http://tunmcdsvn.tun.st.com/Component_Datasheet_Library/Trunk/Connectors/TE_connectivity_FPC_1mm_vertical_2-1734248-0/TEconnectivity_FPC_1mm_vertical_2-1734248-0.pdf; ECCN_US: n/a; ECCN_EU: n/a
H1-H4 = MCD-00035: POSITION HOLE C6D3R5; Part_Type: Mechanical; Initial_Board_Reference: mb1274; Internal_Part_Number: MCD-00035; ECCN_US: n/a; ECCN_EU: n/a; Status: Released; Provided_By: n/a; ComponentLink1Description: Datasheet; Manufacturer: n/a; Manufacturer_Part_Number: n/a
L7 = MCD-00046: SMD Chip ferrite bead, 30R@100MHz +/-30%, 5A, 10mohm DC, S (Standard) material, 0603, T=0.8mm; Part_Type: Inductor; Manufacturer_Part_Number: MPZ1608S300A; Manufacturer: TDK; Provided_By: SUBCO; Initial_Board_Reference: MB1274; Internal_Part_Number: MCD-00046; Status: Released; ComponentLink1Description: Datasheet; ComponentLink1URL: http://tunmcdsvn.tun.st.com/Component_Datasheet_Library/Trunk/Inductors/TDK_Beads_MPZ-series; ECCN_US: n/a; ECCN_EU: n/a
R11 = MCD-00053: as R80 on sheet ST_LINK_V2-1; Internal_Part_Number: MCD-00053; ComponentLink1Description: Datasheet; ECCN_US: n/a; ECCN_EU: n/a; Status: Released; Part_Type: Resistor; ComponentLink1URL: http://tunmcdsvn.tun.st.com/Component_Datasheet_Library/Trunk/Resistors/Yageo_Resistor_RC0402-series; Package: R0402

## Sheet WLAN_BLUETOOTH.SchDoc: WLAN_BLUETOOTH
size A4; Project: STM32MP15-DISCO PI; Date: Not used; ApprovedBy: Not used; CheckedBy: Not used; Author: Not used; CompanyName: STMicroelectronics; DrawnBy: Not used; Engineer: Not used; Organization: Not used; Address1: Not used; Address2: Not used; Address3: Not used; Address4: Not used; DocumentNumber: 14; Revision: Not used; SheetNumber: 14; SheetTotal: 15; CurrentTime: Not used; CurrentDate: Not used; Time: Not used; DocumentFullPathAndName: Not used; DocumentName: Not used; ModifiedDate: Not used; ImagePath: Not used; ProjectName: Not used; Application_BuildNumber: Not used
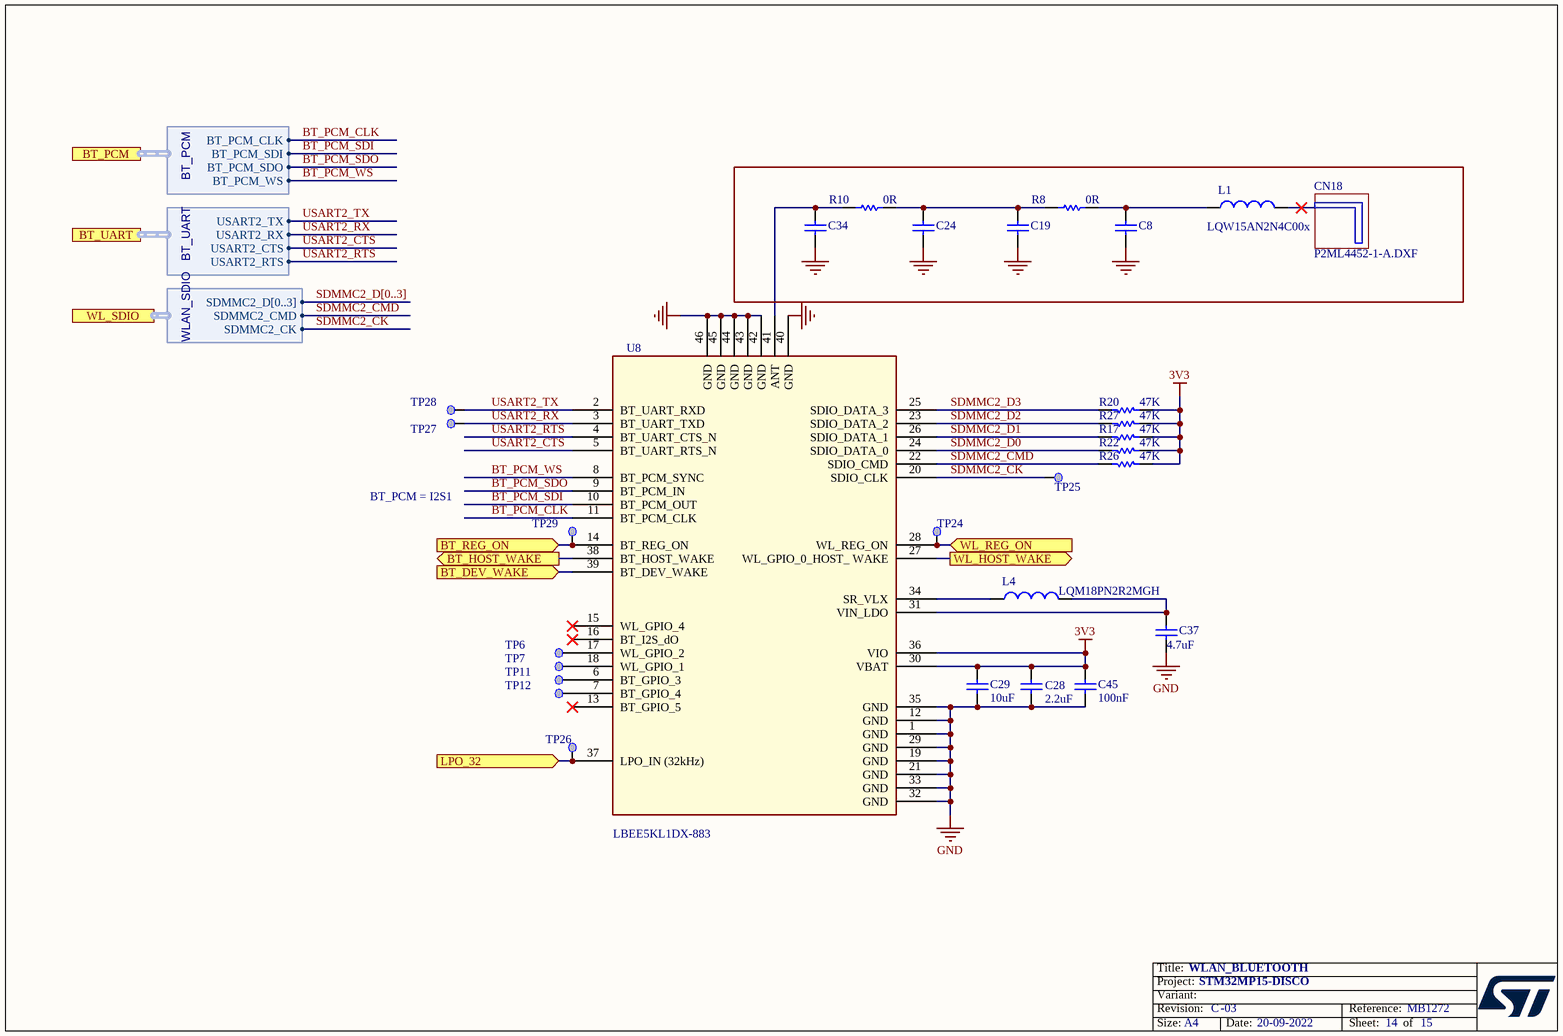
[diagram p9: WLAN_BLUETOOTH.SchDoc]

### Parts
C8  Capacitor  [C0402]  (value not drawn)
C19  Capacitor  [C0402]  (value not drawn)
C24  Capacitor  [C0402]  (value not drawn)
C28  value 2.2uF  [C0603]  (hidden comment: Capacitor)
C29  value 10uF  [C0603]  (hidden comment: Capacitor)
C34  Capacitor  [C0402]  (value not drawn)
C37  value 4.7uF  [C0402]  (hidden comment: Capacitor)
C45  value 100nF  [C0402]
CN18  value P2ML4452-1-A.DXF  [ANT_MURATA_TYPE-1-DX_P2ML4452-1-A_DXF]  (hidden comment: antenna_Wifi_BLE_Murata)  (no BOM)
L1  value LQW15AN2N4C00x  [IND_0402_MURATA_LQW15AN2N4C00X]  (hidden comment: Inductor)
L4  value LQM18PN2R2MGH  [L0603]  (hidden comment: Inductor)
R8  value 0R  [R0402]  (hidden comment: Resistor)
R10  value 0R  [R0402]  (hidden comment: Resistor)
R17  value 47K  [R0402]  (hidden comment: Resistor)
R20  value 47K  [R0402]  (hidden comment: Resistor)
R22  value 47K  [R0402]  (hidden comment: Resistor)
R26  value 47K  [R0402]  (hidden comment: Resistor)
R27  value 47K  [R0402]  (hidden comment: Resistor)
TP6  Test Point  [TP_SMD_1MM]  (value not drawn)  (no BOM)
TP7  Test Point  [TP_SMD_1MM]  (value not drawn)  (no BOM)
TP11  Test Point  [TP_SMD_1MM]  (value not drawn)  (no BOM)
TP12  Test Point  [TP_SMD_1MM]  (value not drawn)  (no BOM)
TP24  Test Point  [TP_SMD_0-6MM]  (value not drawn)  (no BOM)
TP25  Test Point  [TP_SMD_0-6MM]  (value not drawn)  (no BOM)
TP26  Test Point  [TP_SMD_0-6MM]  (value not drawn)  (no BOM)
TP27  Test Point  [TP_SMD_0-6MM]  (value not drawn)  (no BOM)
TP28  Test Point  [TP_SMD_0-6MM]  (value not drawn)  (no BOM)
TP29  Test Point  [TP_SMD_0-6MM]  (value not drawn)  (no BOM)
U8  LBEE5KL1DX-883  [MOD_WLAN-BT_MURATA_LBEE5KL1DX-883]

### Ports
BT_DEV_WAKE (in), BT_HOST_WAKE (out), BT_PCM (harness BT_PCM), BT_REG_ON (in), BT_UART (harness BT_UART), LPO_32 (in), WL_HOST_WAKE (out), WL_REG_ON (in), WL_SDIO (harness WLAN_SDIO)

### Harnesses
BT_PCM: BT_PCM_CLK, BT_PCM_SDI, BT_PCM_SDO, BT_PCM_WS
BT_UART: USART2_TX, USART2_RX, USART2_CTS, USART2_RTS
WLAN_SDIO: SDMMC2_D[0..3], SDMMC2_CMD, SDMMC2_CK

### Nets
3V3: C28.2 C29.2 C45.2 R17.1 R20.1 R22.1 R26.1 R27.1 U8.30(VBAT) U8.36(VIO)
GND: C8.1 C19.1 C24.1 C28.1 C29.1 C34.1 C37.1 C45.1 U8.1(GND) U8.12(GND) U8.19(GND) U8.21(GND) U8.29(GND) U8.32(GND) U8.33(GND) U8.35(GND) U8.40(GND) U8.42(GND) U8.43(GND) U8.44(GND) U8.45(GND) U8.46(GND)
BT_DEV_WAKE: U8.39(BT_DEV_WAKE) ; port BT_DEV_WAKE
BT_HOST_WAKE: U8.38(BT_HOST_WAKE) ; port BT_HOST_WAKE
BT_PCM_CLK: U8.11(BT_PCM_CLK) ; port BT_PCM.BT_PCM_CLK
BT_PCM_SDI: U8.10(BT_PCM_OUT) ; port BT_PCM.BT_PCM_SDI
BT_PCM_SDO: U8.9(BT_PCM_IN) ; port BT_PCM.BT_PCM_SDO
BT_PCM_WS: U8.8(BT_PCM_SYNC) ; port BT_PCM.BT_PCM_WS
BT_REG_ON: TP29.1 U8.14(BT_REG_ON) ; port BT_REG_ON
LPO_32: TP26.1 U8.37(LPO_IN_(32kHz)) ; port LPO_32
SDMMC2_CK: TP25.1 U8.20(SDIO_CLK) ; port WL_SDIO.SDMMC2_CK
SDMMC2_CMD: R26.2 U8.22(SDIO_CMD) ; port WL_SDIO.SDMMC2_CMD
SDMMC2_D0: R22.2 U8.24(SDIO_DATA_0)
SDMMC2_D1: R17.2 U8.26(SDIO_DATA_1)
SDMMC2_D2: R27.2 U8.23(SDIO_DATA_2)
SDMMC2_D3: R20.2 U8.25(SDIO_DATA_3)
USART2_CTS: U8.5(BT_UART_RTS_N) ; port BT_UART.USART2_CTS
USART2_RTS: U8.4(BT_UART_CTS_N) ; port BT_UART.USART2_RTS
USART2_RX: TP27.1 U8.3(BT_UART_TXD) ; port BT_UART.USART2_RX
USART2_TX: TP28.1 U8.2(BT_UART_RXD) ; port BT_UART.USART2_TX
WL_HOST_WAKE: U8.27(WL_GPIO_0_HOST__WAKE) ; port WL_HOST_WAKE
WL_REG_ON: TP24.1 U8.28(WL_REG_ON) ; port WL_REG_ON
NetC8_2: C8.2 L1.1 R8.1
NetC19_2: C19.2 C24.2 R8.2 R10.1
NetC34_2: C34.2 R10.2 U8.41(ANT)
NetC37_2: C37.2 L4.2 U8.31(VIN_LDO)
NetL4_1: L4.1 U8.34(SR_VLX)
NetTP6_1: TP6.1 U8.17(WL_GPIO_2)
NetTP7_1: TP7.1 U8.18(WL_GPIO_1)
NetTP11_1: TP11.1 U8.6(BT_GPIO_3)
NetTP12_1: TP12.1 U8.7(BT_GPIO_4)

Not connected (* = marked no-connect by the designer): L1 2*; U8 13(BT_GPIO_5)* 15(WL_GPIO_4)* 16(BT_I2S_dO)*

### Buses and harness runs
bus SDMMC2_D[0..3]

### Notes on the sheet
- BT_PCM = I2S1
- Title:
- Project:
- Size:
- Revision:
- Variant:
- A4
- -
- Date:
- Reference:
- Sheet:
- of

### Library data of the parts
C8 C19 C24 C34 = MCD-00200: Capacitor, MLCC, 12pF, 50V, NPO, 5%, 0402, T=0,5mm; Manufacturer_Part_Number: CC0402JRNPO9BN120; Manufacturer: YAGEO; Provided_By: SUBCO; Internal_Part_Number: MCD-00200; Value: 12pF; Status: Footprint available; Part_Type: Capacitor; Package: C0402; ComponentLink1Description: Datasheet; ComponentLink1URL: http://tunmcdsvn.tun.st.com/Component_Datasheet_Library/Trunk/Capacitors/Yageo_Capacitor_NP0_16V-to-50V
C28 = MCD-00012: Capacitor, MLCC, 2.2uF, 10V, X5R, 10%, 0603, T=0,8mm; Manufacturer_Part_Number: CC0603KRX5R6BB225; Manufacturer: YAGEO; Alternate_Manufacturer_Part_Number: C0603C225K8PACTU; Alternate_Manufacturer: KEMET; Provided_By: SUBCO; Initial_Board_Reference: MB1274; Internal_Part_Number: MCD-00012; ComponentLink1Description: Datasheet; ECCN_US: n/a; ECCN_EU: n/a; Status: Released; Part_Type: Capacitor; Package: C0603; ComponentLink1URL: http://tunmcdsvn.tun.st.com/Component_Datasheet_Library/Trunk/Capacitors/Yageo_Multilayer_capacitor_X5R_series_100pF_to_100uF
C29 = MCD-00099: Capacitor, MLCC, 10uF, 10V, X5R, 10%, 0603, T=0,8mm; Manufacturer_Part_Number: GRM188R61A106KE69D; Manufacturer: MURATA; ECCN_US: EAR99; ECCN_EU: NEC; Provided_By: SUBCO; Initial_Board_Reference: MB1262; Internal_Part_Number: MCD-00099; Status: Released; Part_Type: Capacitor; Package: C0603; ComponentLink1Description: Datasheet; ComponentLink1URL: http://tunmcdsvn.tun.st.com/Component_Datasheet_Library/Trunk/Capacitors/Murata_Capacitor_GR_series
C37 = MCD-01356: Capacitor, MLCC, 4.7uF, 6V3, X5R, 20%, 0402, T=0,5mm; Manufacturer_Part_Number: GRM155R60J475ME47; Manufacturer: MURATA; Provided_By: SUBCO; Internal_Part_Number: MCD-01356; ComponentLink1Description: Datasheet; Status: Released; Part_Type: Capacitor; Package: C0402; ComponentLink1URL: http://tunmcdsvn.tun.st.com/Component_Datasheet_Library/Trunk/Capacitors/Murata_Capacitor_GR_series
C45 = MCD-00006: Capacitor,100nF,16V,X7R,10%,0402; Manufacturer_Part_Number: CC0402KRX7R7BB104; Manufacturer: YAGEO; Alternate_Manufacturer: MURATA; Alternate_Manufacturer_Part_Number: GCM155R71C104KA55D; Provided_By: SUBCO; Initial_Board_Reference: MB1274; Internal_Part_Number: MCD-00006; ComponentLink1Description: Datasheet; ECCN_US: n/a; ECCN_EU: n/a; Status: Released; Part_Type: Capacitor; Package: C0402; ComponentLink1URL: http://tunmcdsvn.tun.st.com/Component_Datasheet_Library/Trunk/Capacitors/Yageo_Multilayer_Capacitor_X7R_series_100pF_to_22uF
CN18 = MCD-00656: Murata_Type1DX_AntennaDesign_P2ML4452-1-A.DXF; Part_Type: Misc; Manufacturer: MURATA; Initial_Board_Reference: MB1272; Internal_Part_Number: MCD-00656; Status: Footprint available; Manufacturer_Part_Number: Antenna design; ComponentLink1Description: Datasheet; ComponentLink1URL: http://tunmcdsvn.tun.st.com/Component_Datasheet_Library/Trunk/Misc/Murata_Type1DX_AntennaDesign_20160311; ECCN_US: n/a; ECCN_EU: n/a; Provided_By: n/a
L1 = MCD-00657: Inductor,2.4nH,+-0.2nH,0.05R,0.85A,0402; Manufacturer: MURATA; Provided_By: SUBCO; Initial_Board_Reference: MB1272; Internal_Part_Number: MCD-00657; Status: Footprint available; Part_Type: Inductor; Manufacturer_Part_Number: LQW15AN2N4C00x; Package: L0402; ComponentLink1Description: Datasheet; ComponentLink1URL: http://tunmcdsvn.tun.st.com/Component_Datasheet_Library/Trunk/Inductors/Murata_inductor_LQW15AN2N4C00x_; ECCN_US: n/a; ECCN_EU: n/a
L4 = MCD-00659: Inductor, 2.2µH, 20%, Isat 0.35A, DCR 0.2Ohm, 0603; Manufacturer: MURATA; Provided_By: SUBCO; Initial_Board_Reference: MB1272; Internal_Part_Number: MCD-00659; Status: Footprint available; Part_Type: Inductor; Manufacturer_Part_Number: LQM18PN2R2MGH; Package: L0603; ComponentLink1Description: Datasheet; ComponentLink1URL: http://tunmcdsvn.tun.st.com/Component_Datasheet_Library/Trunk/Inductors/Murata_inductor_LQM18PN2R2MGHx; ECCN_US: n/a; ECCN_EU: n/a
R8 R10 = MCD-00052: Resistor,0R,0402,5%,1/16W; Manufacturer_Part_Number: RC0402JR-070RL; Manufacturer: YAGEO; Provided_By: SUBCO; Initial_Board_Reference: MB1274; Internal_Part_Number: MCD-00052; Status: Released; Part_Type: Resistor; Package: R0402; ComponentLink1Description: Datasheet; ComponentLink1URL: http://tunmcdsvn.tun.st.com/Component_Datasheet_Library/Trunk/Resistors/Yageo_Resistor_RC0402-series; ECCN_US: n/a; ECCN_EU: n/a
R17 R20 R22 R26 R27 = MCD-00063: Resistor,47K,0402,1%,1/16W; Manufacturer_Part_Number: RC0402FR-0747KL; Manufacturer: YAGEO; Provided_By: SUBCO; Initial_Board_Reference: MB1274; Internal_Part_Number: MCD-00063; ComponentLink1Description: Datasheet; ECCN_US: n/a; ECCN_EU: n/a; Status: Released; Part_Type: Resistor; ComponentLink1URL: http://tunmcdsvn.tun.st.com/Component_Datasheet_Library/Trunk/Resistors/Yageo_Resistor_RC0402-series; Package: R0402
TP6 TP7 TP11 TP12 = MCD-00074: as TP20 on sheet ST_LINK_V2-1; Internal_Part_Number: MCD-00074; ECCN_US: n/a; ECCN_EU: n/a; Provided_By: n/a; Status: Released; Manufacturer_Part_Number: n/a; Manufacturer: n/a; ComponentLink1Description: Datasheet; ComponentLink1URL: http://na
TP24-TP29 = MCD-00631: Test Point 0.6mm; Part_Type: Mechanical; Initial_Board_Reference: MB1264; Internal_Part_Number: MCD-00631; Status: Released; ECCN_US: n/a; ECCN_EU: n/a; Provided_By: n/a; ComponentLink1Description: Datasheet
U8 = MCD-00268: IEEE802.11b/g/n W-LAN + Bluetooth 4.1+EDR module; Manufacturer: MURATA; Part_Type: IC; Provided_By: SUBCO; ECCN_US: 5A992C; Initial_Board_Reference: MB1272; Value: LBEE5KL1DX-883; Internal_Part_Number: MCD-00268; Manufacturer_Part_Number: LBEE5KL1DX-883; ComponentLink1Description: Datasheet; ComponentLink1URL: http://tunmcdsvn.tun.st.com/Component_Datasheet_Library/Trunk/IC/MURATA_LBEE5KL1DX_wifi_BLE; Status: Checked